# EAGLE design sx3_io_tach (EAGLE 9.5.2)

## Sheet 1 of 2: MAIN
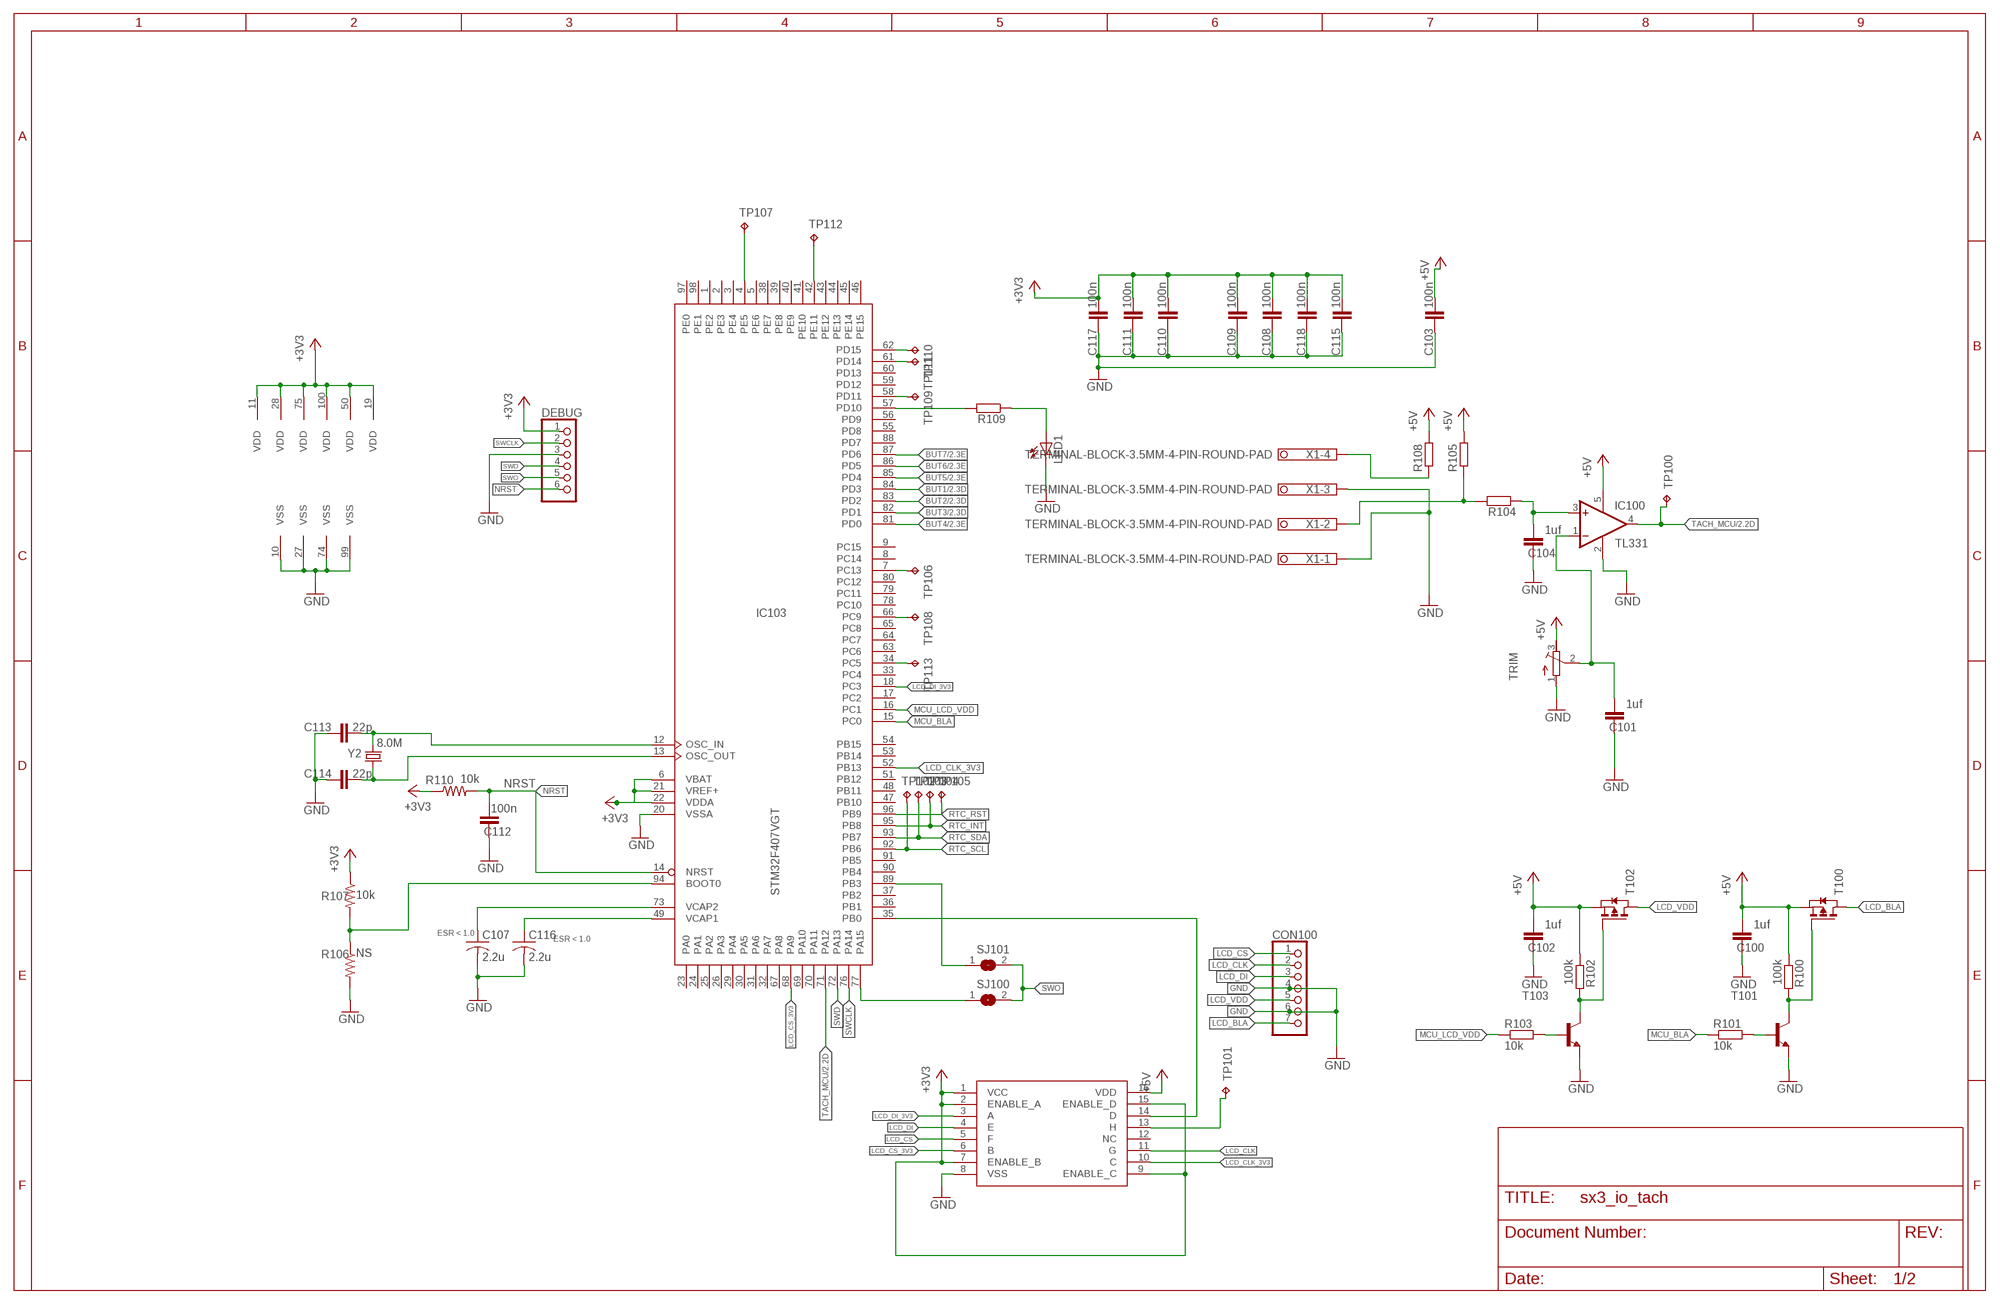
[diagram p0: schematic, sheet 1]

### Parts
C100  1uf  C-EUC0603K  [C0603K]
C101  1uf  C-EUC0603K  [C0603K]
C102  1uf  C-EUC0603K  [C0603K]
C103  100n  C-EUC0603K  [C0603K]
C104  1uf  C-EUC0603K  [C0603K]
C107  2.2u  C-USC1206  [C1206]
C108  100n  C-EUC0603K  [C0603K]
C109  100n  C-EUC0603K  [C0603K]
C110  100n  C-EUC0603K  [C0603K]
C111  100n  C-EUC0603K  [C0603K]
C112  100n  C-EUC0603K  [C0603K]
C113  22p  C-EUC0603K  [C0603K]
C114  22p  C-EUC0603K  [C0603K]
C115  100n  C-EUC0603K  [C0603K]
C116  2.2u  C-USC1206  [C1206]
C117  100n  C-EUC0603K  [C0603K]
C118  100n  C-EUC0603K  [C0603K]
CON100  PINHD-1X7  [1X07]
DEBUG  PINHD-1X6  [1X06]
IC100  TL331  [DBV-R-PDSO-G5]
IC103  STM32F407VGT  [LQFP100]
LED1  LED_ELD260  [LED_LD260]
R100  100k  R-EU_R0603  [R0603]
R101  10k  R-EU_R0603  [R0603]
R102  100k  R-EU_R0603  [R0603]
R103  10k  R-EU_R0603  [R0603]
R104  R-EU_R0603  [R0603]
R105  R-EU_R0603  [R0603]
R106  NS  R-US_R0603  [R0603]
R107  10k  R-US_R0603  [R0603]
R108  R-EU_R0603  [R0603]
R109  R-EU_R0603  [R0603]
R110  10k  R-US_R0603  [R0603]
SJ100  SJ  [SJ]
SJ101  SJ  [SJ]
T100  PMOSSOT23  [SOT-23]
T101  BC817-NPN-SOT23-BEC  [SOT23-BEC]
T102  PMOSSOT23  [SOT-23]
T103  BC817-NPN-SOT23-BEC  [SOT23-BEC]
TP100  TPB1,27  [B1,27]
TP101  TPB1,27  [B1,27]
TP102  TPTP17R  [TP17R]
TP103  TPTP17R  [TP17R]
TP104  TPTP17R  [TP17R]
TP105  TPTP17R  [TP17R]
TP106  TPTP17R  [TP17R]
TP107  TPTP17R  [TP17R]
TP108  TPTP17R  [TP17R]
TP109  TPTP17R  [TP17R]
TP110  TPTP17R  [TP17R]
TP111  TPTP17R  [TP17R]
TP112  TPTP17R  [TP17R]
TP113  TPTP17R  [TP17R]
TRIM  R-TRIMM3296W  [RTRIM3296W]
U$100  CD40109BPWR  [TSSOP16]
X1  TERMINAL-BLOCK-3.5MM-4-PIN-ROUND-PAD  [TERMINAL-BLOCK-4-PIN-3.5MM-ROUND-PAD]
Y2  8.0M  CRYSTALHC49UV  [HC49U-V]

### Nets
+3V3: C108.2 C109.2 C110.2 C111.2 C115.2 C117.2 C118.2 DEBUG.1 IC103.6(VBAT) IC103.11(VDD) IC103.19(VDD) IC103.21(VREF+) IC103.22(VDDA) IC103.28(VDD) IC103.50(VDD) IC103.75(VDD) IC103.100(VDD) R107.1 R110.1 U$100.1(VCC) U$100.2(ENABLE_A) U$100.7(ENABLE_B) U$100.9(ENABLE_C) U$100.15(ENABLE_D) ; also sheet 2
+5V: C100.2 C102.2 C103.2 IC100.5(V+) R100.1 R102.1 R105.2 R108.2 T100.2(S) T102.2(S) TRIM.3(E) U$100.16(VDD) ; also sheet 2
BOOT0: IC103.94(BOOT0) R106.1 R107.2
BUT1: IC103.84(PD3) ; also sheet 2
BUT2: IC103.83(PD2) ; also sheet 2
BUT3: IC103.82(PD1) ; also sheet 2
BUT4: IC103.81(PD0) ; also sheet 2
BUT5: IC103.85(PD4) ; also sheet 2
BUT6: IC103.86(PD5) ; also sheet 2
BUT7: IC103.87(PD6) ; also sheet 2
GND: C100.1 C101.1 C102.1 C103.1 C104.1 C107.2 C108.1 C109.1 C110.1 C111.1 C112.1 C113.1 C114.1 C115.1 C116.2 C117.1 C118.1 CON100.4 CON100.6 DEBUG.3 IC100.2(GND) IC103.10(VSS) IC103.20(VSSA) IC103.27(VSS) IC103.74(VSS) IC103.99(VSS) LED1.K(C) R106.2 T101.E T103.E TRIM.1(A) U$100.8(VSS) X1.1 X1.3 ; also sheet 2
LCD_BLA: CON100.7 T100.1(D)
LCD_CLK: CON100.2 U$100.11(G)
LCD_CLK_3V3: IC103.52(PB13) U$100.10(C)
LCD_CS: CON100.1 U$100.5(F)
LCD_CS_3V3: IC103.68(PA9) U$100.6(B)
LCD_DI: CON100.3 U$100.4(E)
LCD_DI_3V3: IC103.18(PC3) U$100.3(A)
LCD_VDD: CON100.5 T102.1(D)
MCU_BLA: IC103.15(PC0) R101.1
MCU_LCD_VDD: IC103.16(PC1) R103.1
N$1: C101.2 IC100.1(-IN) TRIM.2(S)
N$2: IC103.57(PD10) R109.2
N$3: LED1.A R109.1
N$4: R101.2 T101.B
N$5: R103.2 T103.B
N$6: IC103.35(PB0) U$100.14(D)
N$7: R102.2 T102.3(G) T103.C
N$8: TP101.TP U$100.13(H)
N$9: R100.2 T100.3(G) T101.C
N$10: R108.1 X1.4
N$11: IC103.4(PE5) TP107.TP
N$12: R104.2 R105.1 X1.2
N$13: IC103.42(PE11) TP112.TP
N$14: C104.2 IC100.3(+IN) R104.1
N$15: IC103.66(PC9) TP108.TP
N$16: IC103.7(PC13) TP106.TP
N$17: IC103.34(PC5) TP113.TP
N$18: IC103.61(PD14) TP111.TP
N$19: IC103.62(PD15) TP110.TP
N$20: IC103.58(PD11) TP109.TP
N$21: IC103.89(PB3) SJ101.1
N$22: IC103.77(PA15) SJ100.1
NRST: C112.2 DEBUG.6 IC103.14(NRST) R110.2
OSC_IN: C113.2 IC103.12(OSC_IN) Y2.2
OSC_OUT: C114.2 IC103.13(OSC_OUT) Y2.1
RTC_INT: IC103.95(PB8) TP104.TP
RTC_RST: IC103.96(PB9) TP105.TP
RTC_SCL: IC103.92(PB6) TP102.TP
RTC_SDA: IC103.93(PB7) TP103.TP
SWCLK: DEBUG.2 IC103.76(PA14)
SWD: DEBUG.4 IC103.72(PA13)
SWO: DEBUG.5 SJ100.2 SJ101.2
TACH_MCU: IC100.4(OUT) IC103.71(PA12) TP100.TP ; also sheet 2
VCAP1: C116.1 IC103.49(VCAP1)
VCAP2: C107.1 IC103.73(VCAP2)
Unconnected: IC103.1(PE2) IC103.2(PE3) IC103.3(PE4) IC103.5(PE6) IC103.8(PC14) IC103.9(PC15) IC103.17(PC2) IC103.23(PA0) IC103.24(PA1) IC103.25(PA2) IC103.26(PA3) IC103.29(PA4) IC103.30(PA5) IC103.31(PA6) IC103.32(PA7) IC103.33(PC4) IC103.36(PB1) IC103.37(PB2) IC103.38(PE7) IC103.39(PE8) IC103.40(PE9) IC103.41(PE10) IC103.43(PE12) IC103.44(PE13) IC103.45(PE14) IC103.46(PE15) IC103.47(PB10) IC103.48(PB11) IC103.51(PB12) IC103.53(PB14) IC103.54(PB15) IC103.55(PD8) IC103.56(PD9) IC103.59(PD12) IC103.60(PD13) IC103.63(PC6) IC103.64(PC7) IC103.65(PC8) IC103.67(PA8) IC103.69(PA10) IC103.70(PA11) IC103.78(PC10) IC103.79(PC11) IC103.80(PC12) IC103.88(PD7) IC103.90(PB4) IC103.91(PB5) IC103.97(PE0) IC103.98(PE1) U$100.12(NC)

### Notes on the sheet
- ESR < 1.0
- ESR < 1.0

## Sheet 2 of 2: POWER
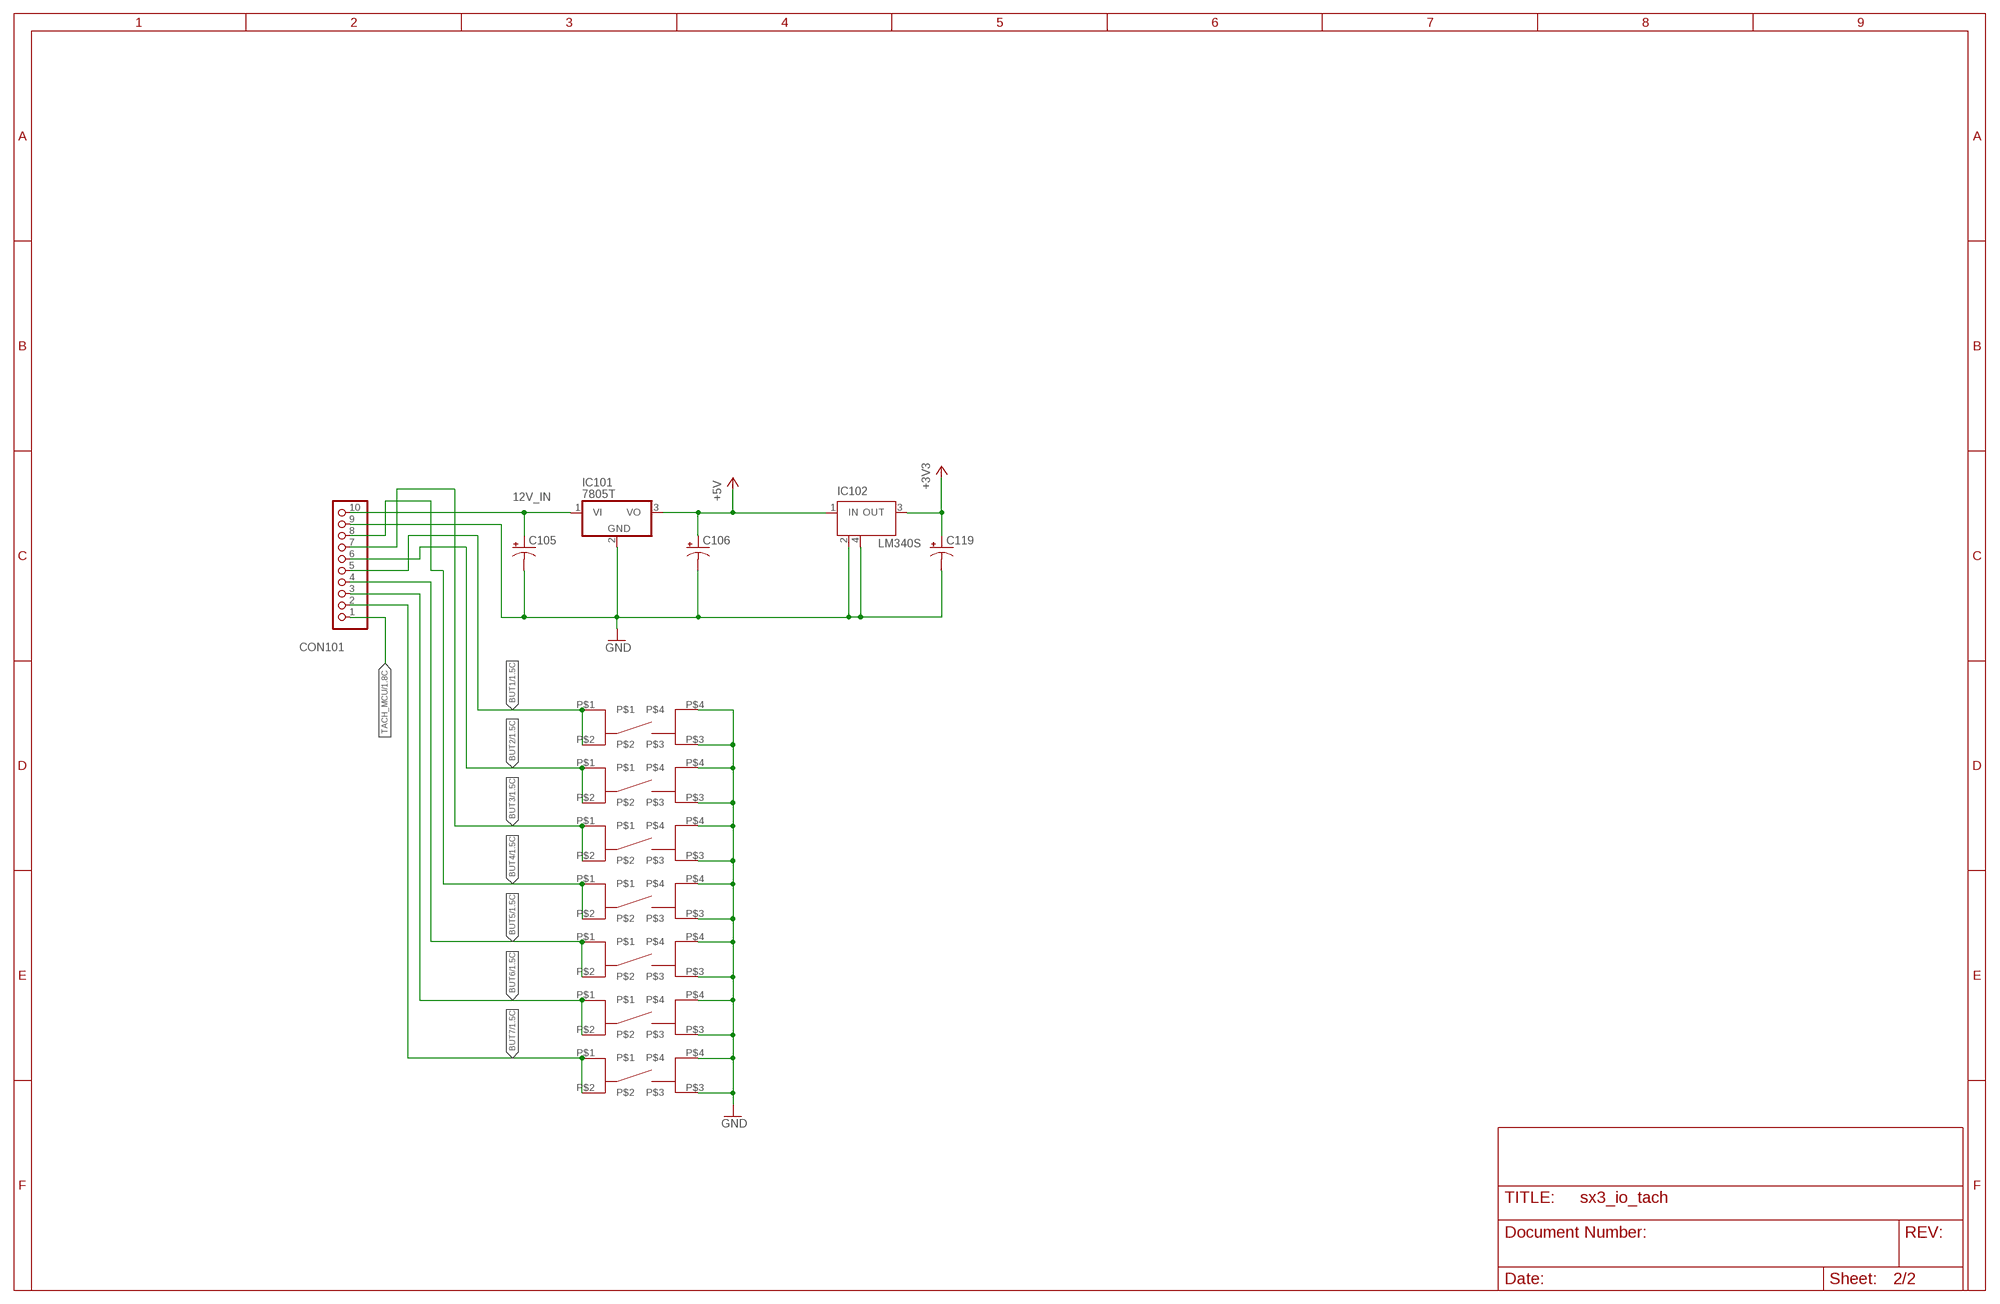
[diagram p1: schematic, sheet 2]

### Parts
C105  CPOL-USE2,5-6E  [E2,5-6E]
C106  CPOL-USE2,5-6E  [E2,5-6E]
C119  CPOL-USE2,5-6E  [E2,5-6E]
CON101  PINHD-1X10  [1X10]
IC101  7805T  [TO220H]
IC102  LM340S  [SOT223]
U$1  TE_2-1825910  [TE_2-1825910-7]
U$2  TE_2-1825910  [TE_2-1825910-7]
U$3  TE_2-1825910  [TE_2-1825910-7]
U$4  TE_2-1825910  [TE_2-1825910-7]
U$5  TE_2-1825910  [TE_2-1825910-7]
U$6  TE_2-1825910  [TE_2-1825910-7]
U$7  TE_2-1825910  [TE_2-1825910-7]

### Nets
12V_IN: C105.+ CON101.10 IC101.1(VI)
+3V3: C119.+ IC102.3(OUT) ; also sheet 1
+5V: C106.+ IC101.3(VO) IC102.1(IN) ; also sheet 1
BUT1: CON101.5 U$7.P$1 U$7.P$2 ; also sheet 1
BUT2: CON101.6 U$5.P$1 U$5.P$2 ; also sheet 1
BUT3: CON101.7 U$3.P$1 U$3.P$2 ; also sheet 1
BUT4: CON101.8 U$1.P$1 U$1.P$2 ; also sheet 1
BUT5: CON101.4 U$2.P$1 U$2.P$2 ; also sheet 1
BUT6: CON101.3 U$4.P$1 U$4.P$2 ; also sheet 1
BUT7: CON101.2 U$6.P$1 U$6.P$2 ; also sheet 1
GND: C105.- C106.- C119.- CON101.9 IC101.2(GND) IC102.2(GND) IC102.4(GND) U$1.P$3 U$1.P$4 U$2.P$3 U$2.P$4 U$3.P$3 U$3.P$4 U$4.P$3 U$4.P$4 U$5.P$3 U$5.P$4 U$6.P$3 U$6.P$4 U$7.P$3 U$7.P$4 ; also sheet 1
TACH_MCU: CON101.1 ; also sheet 1

## Library data of the parts
C100-C104 C108-C115 C117 C118 = rcl:C-EU: CAPACITOR, European symbol
C105 C106 C119 = rcl:CPOL-US: POLARIZED CAPACITOR, American symbol; SPICEPREFIX: C
C107 C116 = rcl:C-US: CAPACITOR, American symbol
CON100 = pinhead:PINHD-1X7: PIN HEADER
CON101 = pinhead:PINHD-1X10: PIN HEADER
DEBUG = pinhead:PINHD-1X6: PIN HEADER
IC100 = linear:TL331: SINGLE DIFFERENTIAL COMPARATOR Source: Data sheet <http://www.ti.com/lit/ds/symlink/tl331-q1.pdf>
IC101 = linear:78*: Positive VOLTAGE REGULATOR Source: http://cache.national.com/ds/LM/LM78L05.pdf http://www.fairchildsemi.com/ds/LM/LM7805.pdf
IC102 = linear:LM340S: 3-Terminal Positive Regulators Source: http://cache.national.com/ds/LM/LM340.pdf
IC103 = micro-stm:STM32F407V*T: ARM 32-bit Cortex™-M3 CPU 168 MHz maximum frequency 512 to 1024 Kbytes of Flash memory 192 kbytes of SRAM 82 GPIOs 1.8 to 3.6 V application supply
LED1 = eagle-ltspice:LED_E: LED Source: http://www.osram.convergy.de Source: www.luxeon.com Source: www.kingbright.com; SPICEMODEL: NONE; SPICEPREFIX: D; SPICETYPE: diode
R100-R105 R108 R109 = resistor:R-EU_: RESISTOR, European symbol
R106 R107 R110 = rcl:R-US_: RESISTOR, American symbol
SJ100 SJ101 = jumper:SJ: SMD solder JUMPER
T100 T102 = zetex:PMOSSOT23: MOS FET; OC_FARNELL: unknown; OC_NEWARK: unknown
T101 T103 = transistor-neu-to92:*-NPN-: NPN Transistror
TP100-TP113 = testpad:TP: Test pad
TRIM = rcl:R-TRIMM: Trimm resistor; SPICEMODEL: X; SPICEPREFIXL: POT
U$1-U$7 = eric_sorensen:TE_2-1825910
U$100 = eric_sorensen:CD40109BPWR
X1 = Rembrandt Electronics - Terminal Block 3-5mm v1-0:TERMINAL-BLOCK-3.5MM-4-PIN: Terminal Block 3.5mm Pitch: 3,5 mm Number of pins: 4 Created by Rembrandt Electronics www.rembrandtelectronics.com
Y2 = SparkFun-FreqCtrl:CRYSTAL: Various standard crystals. Proven footprints.

## Board
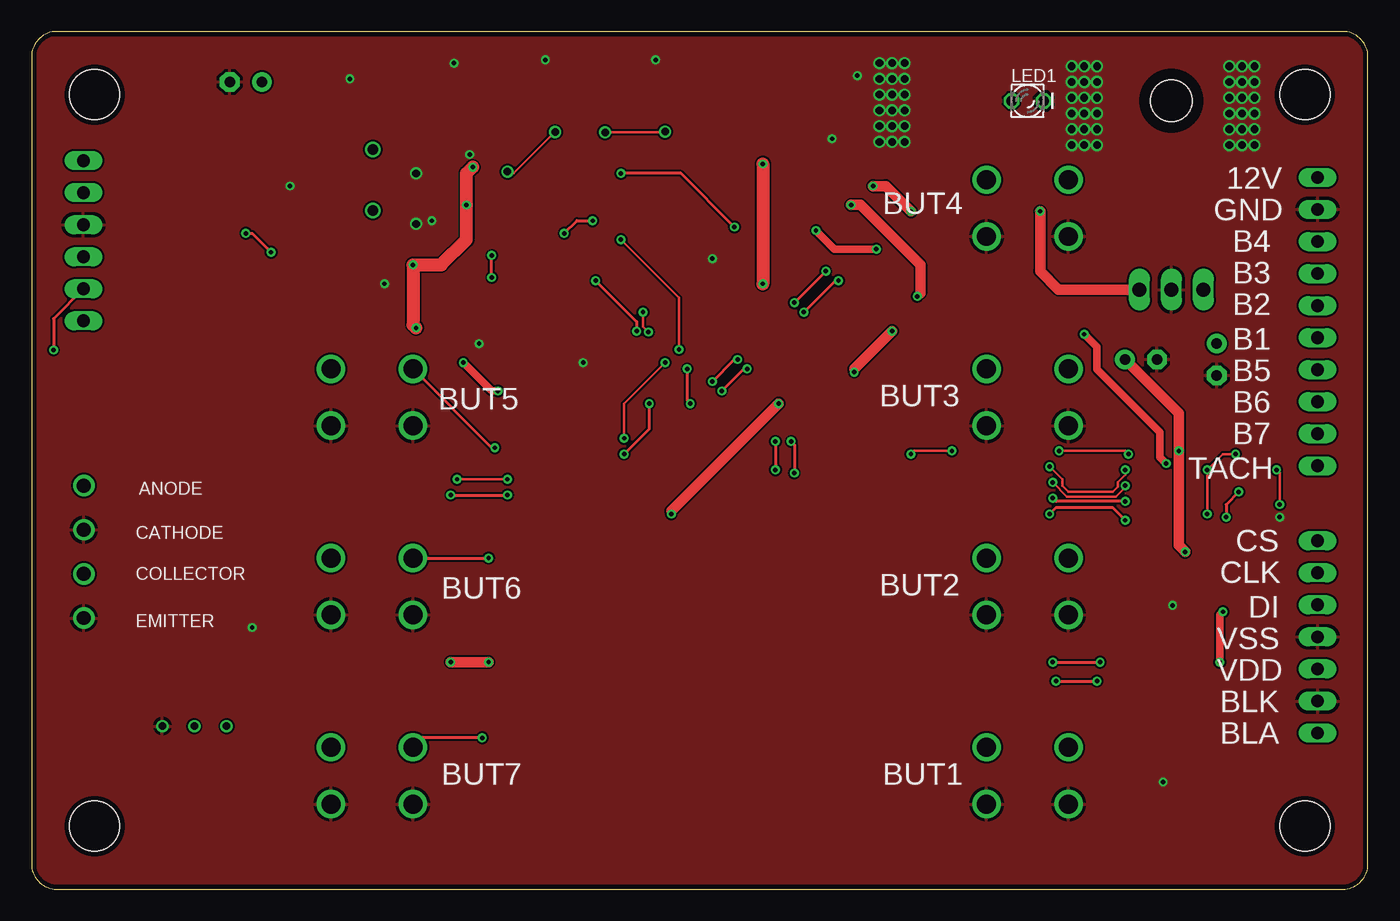
[diagram p2: board, top side]
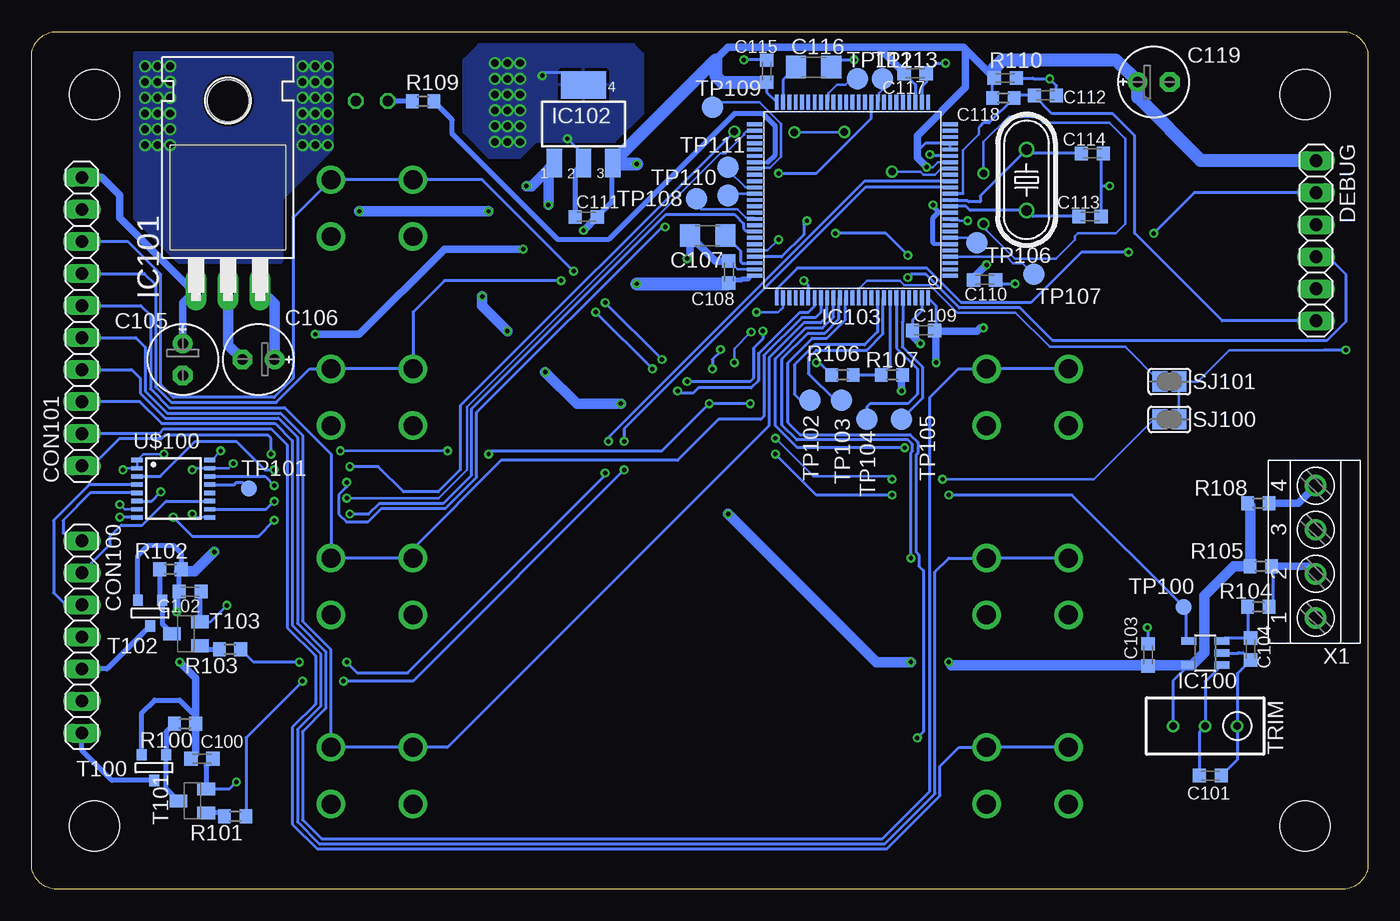
[diagram p3: board, bottom side, seen from below]

Size 106 x 68 mm. Coordinates in mm from the lower left corner, seen from the top.
Outline: 0,66 0,2 arc90 2,0 104,0 arc90 106,2 106,66 arc90 104,68 2,68 arc90 0,66
Copper layers (1*16): Top 0.0356mm / dielectric 1.5011mm / Bottom 0.0356mm
Design rules "LaenPCBOrder": minimum track width 6mil, minimum drill 13mil, track to track 6mil, track to pad 6mil, pad to pad 6mil, via to via 6mil, smd to smd 6mil, copper to edge 15mil, drill to drill 6mil, minimum pad ring 7mil, minimum via ring 7mil, stop-mask expansion 3mil, vias tented up to drill 0mil, thermal gap 10mil
Holes 4 mm at 101,63 101,5 5,5 5,63

### Footprints (pad centres in the part's own frame; a part is rotated, then mirrored left to right if it is on the bottom)
C0603K = smd 1.05 x 1.08: 1 -0.875,0; 2 0.875,0
E2,5-6E = drill 0.813 pad 1.575: + -1.27,0 | drill 0.813 pad 1.575 octagon: - 1.27,0
C1206 = smd 1.6 x 1.8: 1 -1.4,0; 2 1.4,0
1X07 = drill 1.016 long: 1 -7.62,0; 2 -5.08,0; 3 -2.54,0; 4 0,0; 5 2.54,0; 6 5.08,0; 7 7.62,0
1X10 = drill 1.016 long: 1 -11.43,0; 2 -8.89,0; 3 -6.35,0; 4 -3.81,0; 5 -1.27,0; 6 1.27,0; 7 3.81,0; 8 6.35,0; 9 8.89,0; 10 11.43,0
1X06 = drill 1.016 long: 1 -6.35,0; 2 -3.81,0; 3 -1.27,0; 4 1.27,0; 5 3.81,0; 6 6.35,0
DBV-R-PDSO-G5 = smd 0.6 x 1.2: 1 -0.95,-1.306; 2 0,-1.306; 3 0.95,-1.306; 4 0.95,1.306; 5 -0.95,1.306
TO220H = drill 1.118 long: 1 -2.54,-10.16; 2 0,-10.16; 3 2.54,-10.16 | hole 3.302: 0,4.826
SOT223 = smd 1.219 x 2.235: 1 -2.311,-3.099; 2 0,-3.099; 3 2.311,-3.099 | smd 3.6 x 2.2: 4 0,3.099
LQFP100 = smd 0.3 x 1.2: 1 -6,-7.75; 2 -5.5,-7.75; 3 -5,-7.75; 4 -4.5,-7.75; 5 -4,-7.75; 6 -3.5,-7.75; 7 -3,-7.75; 8 -2.5,-7.75; 9 -2,-7.75; 10 -1.5,-7.75; 11 -1,-7.75; 12 -0.5,-7.75; 13 0,-7.75; 14 0.5,-7.75; 15 1,-7.75; 16 1.5,-7.75; 17 2,-7.75; 18 2.5,-7.75; 19 3,-7.75; 20 3.5,-7.75; 21 4,-7.75; 22 4.5,-7.75; 23 5,-7.75; 24 5.5,-7.75; 25 6,-7.75; 51 6,7.75; 52 5.5,7.75; 53 5,7.75; 54 4.5,7.75; 55 4,7.75; 56 3.5,7.75; 57 3,7.75; 58 2.5,7.75; 59 2,7.75; 60 1.5,7.75; 61 1,7.75; 62 0.5,7.75; 63 0,7.75; 64 -0.5,7.75; 65 -1,7.75; 66 -1.5,7.75; 67 -2,7.75; 68 -2.5,7.75; 69 -3,7.75; 70 -3.5,7.75; 71 -4,7.75; 72 -4.5,7.75; 73 -5,7.75; 74 -5.5,7.75; 75 -6,7.75 | smd 1.2 x 0.3: 26 7.75,-6; 27 7.75,-5.5; 28 7.75,-5; 29 7.75,-4.5; 30 7.75,-4; 31 7.75,-3.5; 32 7.75,-3; 33 7.75,-2.5; 34 7.75,-2; 35 7.75,-1.5; 36 7.75,-1; 37 7.75,-0.5; 38 7.75,0; 39 7.75,0.5; 40 7.75,1; 41 7.75,1.5; 42 7.75,2; 43 7.75,2.5; 44 7.75,3; 45 7.75,3.5; 46 7.75,4; 47 7.75,4.5; 48 7.75,5; 49 7.75,5.5; 50 7.75,6; 76 -7.75,6; 77 -7.75,5.5; 78 -7.75,5; 79 -7.75,4.5; 80 -7.75,4; 81 -7.75,3.5; 82 -7.75,3; 83 -7.75,2.5; 84 -7.75,2; 85 -7.75,1.5; 86 -7.75,1; 87 -7.75,0.5; 88 -7.75,0; 89 -7.75,-0.5; 90 -7.75,-1; 91 -7.75,-1.5; 92 -7.75,-2; 93 -7.75,-2.5; 94 -7.75,-3; 95 -7.75,-3.5; 96 -7.75,-4; 97 -7.75,-4.5; 98 -7.75,-5; 99 -7.75,-5.5; 100 -7.75,-6
LED_LD260 = drill 0.813 octagon: A -1.27,0; K 1.27,0
R0603 = smd 1 x 1.1: 1 -0.85,0; 2 0.85,0
SJ = smd 1.168 x 1.6: 1 -0.762,0; 2 0.762,0
SOT-23 = smd 0.787 x 0.889: 1 0.025,-1.016; 2 -0.94,1.016; 3 0.991,1.016
SOT23-BEC = smd 1 x 1.4: B -0.95,-1.1; C 0,1.1; E 0.95,-1.1
B1,27 = smd 1.27 x 1.27: TP 0,0
TP17R = smd 1.7 x 1.7: TP 0,0
RTRIM3296W = drill 0.61: 1 0,-2.54; 2 0,0; 3 0,2.54
TE_2-1825910-7 = drill 1.5: P$1 -3.25,2.25; P$2 3.25,2.25; P$3 3.25,-2.25; P$4 -3.25,-2.25
TSSOP16 = smd 0.9 x 0.35: 1 -2.875,2.275; 2 -2.875,1.625; 3 -2.875,0.975; 4 -2.875,0.325; 5 -2.875,-0.325; 6 -2.875,-0.975; 7 -2.875,-1.625; 8 -2.875,-2.275; 9 2.875,-2.275; 10 2.875,-1.625; 11 2.875,-0.975; 12 2.875,-0.325; 13 2.875,0.325; 14 2.875,0.975; 15 2.875,1.625; 16 2.875,2.275
TERMINAL-BLOCK-4-PIN-3.5MM-ROUND-PAD = drill 1.1 pad 1.7: 1 -5.25,-0.1; 2 -1.75,-0.1; 3 1.75,-0.1; 4 5.25,-0.1
HC49U-V = drill 0.813: 1 -2.413,0; 2 2.413,0

### Placement (x,y rotation side)
C100  92.49,10.34 180 bottom
C101  12.5,9 180 bottom
C102  93.42,23.59 180 bottom
C103  17.44,18.58 270 bottom
C104  9.31,19.04 90 bottom
C105  94,42 270 bottom
C106  88,42 180 bottom
C107  52.37,51.82 180 bottom
C108  50.69,48.93 270 bottom
C109  35.25,44.31 0 bottom
C110  30.41,48.31 180 bottom
C111  62.01,53.31 0 bottom
C112  25.58,62.94 180 bottom
C113  22.05,53.34 180 bottom
C114  21.86,58.34 180 bottom
C115  47.69,64.85 270 bottom
C116  43.98,65.18 0 bottom
C117  35.91,64.69 180 bottom
C118  28.77,64.31 180 bottom
C119  17,64 0 bottom
CON100  102,20 270 bottom
CON101  102,45 90 bottom
DEBUG  4.12,51.41 270 bottom
IC100  12.91,18.72 90 bottom
IC101  90.41,57.7 0 bottom
IC102  62.22,60.67 0 bottom
IC103  40.89,54.64 90 bottom
LED1  79,62.5 0 top
R100  93.83,13.12 180 bottom
R101  89.84,5.77 180 bottom
R102  94.98,25.37 180 bottom
R103  90.26,19.02 180 bottom
R104  8.69,22.39 0 bottom
R105  8.5,25.61 180 bottom
R106  41.67,40.77 180 bottom
R107  37.75,40.77 180 bottom
R108  8.69,30.61 180 bottom
R109  74.95,62.47 0 bottom
R110  28.92,62.73 0 bottom
SJ100  15.75,37.25 0 bottom
SJ101  15.75,40.25 0 bottom
T100  96.31,9.64 0 bottom
T101  93.25,7 90 bottom
T102  96.62,21.89 0 bottom
T103  93.75,20.25 90 bottom
TP100  14.62,22.39 0 bottom
TP101  88.75,31.75 0 bottom
TP102  44.25,38.75 0 bottom
TP103  41.75,38.75 0 bottom
TP104  39.75,37.25 0 bottom
TP105  37,37.25 0 bottom
TP106  31,51.25 0 bottom
TP107  26.5,48.75 0 bottom
TP108  53.25,54.75 0 bottom
TP109  52,62 0 bottom
TP110  50.75,55 0 bottom
TP111  50.75,57.25 0 bottom
TP112  40.5,64.25 0 bottom
TP113  38.5,64.25 0 bottom
TRIM  12.92,12.93 90 bottom
U$1  79,54 0 top
U$2  27,39 0 top
U$3  79,39 0 top
U$4  27,24 0 top
U$5  79,24 0 top
U$6  27,9 0 top
U$7  79,9 0 top
U$100  94.75,31.75 0 bottom
X1  4.25,26.75 90 bottom
Y2  27.08,56.23 270 bottom

### Tracks (layer width: path | path; a pad name or v marks a point on that pad's centre or on a via)
12V_IN
  Bottom 0.4: IC101.1 93.29,47.54
  Bottom 0.61: IC101.1 94,46.49 C105.+ | 93.29,47.54 99,53.25 99,55 100.43,56.43 CON101.10
+3V3  (via drill 0.33, 0.35)
  Top 0.2: v93.25,29.75 v93.25,33.25 94.5,34.5 v95.5,34.5 | v98.75,33.25 99,33 v99,30.5
  Top 0.61: v37,39.5 36.5,39.5 v34.25,41.75 | v62.22,52.22 63.7,50.75 v67,50.75 | v83.5,44 84.48,43.02 84.48,41.23 89.5,36.22 89.5,34.25 v90,33.75
  Top 1.016: v30.5,44.5 30.25,44.75 v30.25,49.5 32.5,49.5 34.5,51.5 v34.5,54.25 34.5,56.75 v35,57.25 | v58,57.5 v58,48
  Bottom 0.2: v90,33.75 90.38,33.38 U$100.15 93.12,33.38 v93.25,33.25 | v93.25,29.75 92.97,29.48 U$100.9 | v95.5,34.5 97.15,34.5 U$100.1 U$100.2 98.62,33.38 v98.75,33.25 | v99,30.5 98.62,30.12 U$100.7 | v35,57.25 34.5,57.25 34.11,57.64 IC103.19 | 35.75,58.5 35.75,58
  Bottom 0.254: IC103.100 34.25,46.25 34.25,44.44 C109.2 | IC103.21 IC103.22 35.11,59.14 35.75,58.5 | R110.1 29.77,64.19 C118.2 | C115.2 47.69,63.19 IC103.50 | C117.2 35.89,63.8 IC103.28 | 34.11,53.64 34.5,54.03 v34.5,54.25 33.89,53.64
  Bottom 0.305: IC103.75 48.89,48.64 49.14,48.39 | IC103.6 34.39,51.14 34.5,51.25 | 33.89,53.64 IC103.11
  Bottom 0.4: 34.5,51.25 34.5,53.25 34.11,53.64
  Bottom 0.406: IC102.3 60,57.48 60,54.45 C111.2 | 49.14,48.39 49.64,48.39 49.73,48.3 50.44,48.3 C108.2
  Bottom 0.61: 29.64,65.11 C118.2 31.92,66.58 | R107.1 37,40.67 v37,39.5 | v34.25,41.75 34.25,44.44 | C110.2 31.29,48.47 v30.25,49.5 | v30.5,44.5 30.75,44.5 31,44.25 34.31,44.25 C109.2 | C117.2 38.84,66.75 | 38.84,66.75 50.75,66.75 51.75,65.75 | 31.92,66.58 32.09,66.75 38.84,66.75 | 60,57.5 60,57.48 | IC102.3 59.84,57.5 | 50.74,48 C108.2 | v67,50.75 73.25,50.75 80,44 v83.5,44 | 31.92,66.58 31.92,63.58 35.75,59.75 35.75,58 v35,57.25 | v62.22,52.22 C111.2
  Bottom 1.016: 29.64,65.11 29,65.75 20.02,65.75 C119.+ 18.27,62.77 13.26,57.76 DEBUG.1 | C115.2 51.23,63.98 51.75,64.5 51.75,65.75 60,57.5 | 59.84,57.5 v58,57.5 | v58,48 50.74,48
+5V  (via drill 0.35)
  Top 0.61: v94.25,18 94.25,21.75 v94.5,22 | 70.5,47.25 v70.25,47 | 65.25,41.25 v65.25,41 | 50.75,30 v50.75,29.75
  Top 0.813: C106.+ 91,37.73 v91,34.75 91,27.25 v91.5,26.75 | v66.75,55.75 67.75,55.75 v69.75,53.75 | IC101.3 81.46,47.54 80,49 v80,53.75 | v65,54.25 65.75,54.25 70.5,49.5 70.5,47.25 | v68.25,44.25 65.25,41.25 | v59.25,38.5 50.75,30 | v36.25,18 v33.25,18
  Bottom 0.203: v91,34.75 91.72,34.02 U$100.16
  Bottom 0.254: 9.35,30.42 R108.2 | 17.25,17.77 17.38,17.77 C103.2 | TRIM.3 15.46,16.53 IC100.5 13.98,17.77
  Bottom 0.406: C102.2 94.3,25.2 R102.1 94.13,26.63 94.75,27.25 96.75,27.25 97.56,26.44 T102.2 | T100.2 97.25,14 96.25,15 94.25,15 92.98,13.73 R100.1
  Bottom 0.61: C100.2 92.98,10.72 R100.1 92.98,16.73 v94.25,18 | v94.5,22 94.5,23.39 C102.2 | IC102.1 65,57.1 | v33.25,18 33.02,17.77
  Bottom 0.813: IC101.3 86.73,46.4 C106.+ | 9.35,30.42 R105.2 10.64,25.61 13,23.25 13,18.75 13.98,17.77 | IC100.5 17.25,17.77 33.02,17.77 | v91.5,26.75 93.05,25.2 94.3,25.2 | IC102.1 66.35,55.75 v66.75,55.75 | v69.75,53.75 v80,53.75 | 65,57.1 v65,54.25 | v70.25,47 70.25,46.25 v68.25,44.25 | v65.25,41 62.75,38.5 v59.25,38.5 | v50.75,29.75 39,18 v36.25,18
BOOT0
  Bottom 0.254: R106.1 R107.2 37.89,41.48 IC103.94
BUT1
  Bottom 0.254: CON101.5 97.73,43.73 96.97,42.97 96.97,39.49 95.22,37.75 86.25,37.75 84.5,36 84.5,21.25 82.25,19 U$7.P$2 U$7.P$1 73,11.25 47.5,36.75 47.5,42.15 44.74,44.91 43.42,44.91 42.96,45.36 42.96,46.82 IC103.84
BUT2
  Bottom 0.254: CON101.6 97.33,46.27 96.56,45.5 96.56,39.66 95.09,38.19 85.94,38.19 82.25,34.5 U$5.P$2 U$5.P$1 75.75,27 68.75,34 54.75,34 51.5,37.25 48.16,37.25 47.91,37.5 47.91,42.32 44.91,45.31 43.8,45.31 43.37,45.75 43.37,45.87 43.39,45.89 IC103.83
BUT3  (via drill 0.35)
  Top 0.254: v54.75,39.5 56.5,41.25 v56.75,41.25 | v61.25,45.75 63.75,48.25 v64,48.25
  Bottom 0.254: CON101.7 97.06,48.81 96.16,47.91 96.16,39.83 94.92,38.59 86.58,38.59 83.92,41.25 U$3.P$2 U$3.P$1 75.75,45.75 73.25,48.25 v64,48.25 | IC103.82 43.96,46.82 43.96,46.17 44.42,45.72 45.08,45.72 48.34,42.45 48.34,40.33 48.92,39.75 53.11,39.75 53.49,39.37 54.62,39.37 v54.75,39.5 | v56.75,41.25 v61.25,45.75
BUT4  (via drill 0.35)
  Top 0.254: v44.75,48.25 48,45 v48,44.25 | v54,40.25 55.75,42 v56,42 | v60.5,46.5 v63,49
  Bottom 0.254: CON101.8 98.35,51.35 95.75,48.75 95.75,40 94.75,39 86.75,39 85.25,40.5 85.25,53.25 U$1.P$2 U$1.P$1 70.25,56.25 v63,49 | IC103.81 44.39,47.89 v44.75,48.25 | v48,44.25 48,43.62 48.75,42.87 48.75,40.5 49,40.25 v54,40.25 | v56,42 v60.5,46.5
BUT5  (via drill 0.35)
  Top 0.254: U$2.P$2 36.5,35 v36.75,35
  Bottom 0.254: U$2.P$1 U$2.P$2 32.5,41.25 34.75,39 34.75,7.75 38.5,4 83,4 84.5,5.5 84.5,12.5 82.66,14.34 82.66,18.83 84.91,21.08 84.91,35.83 86.42,37.34 95.39,37.34 97.38,39.33 97.38,40.5 98.07,41.19 CON101.4 | v36.75,35 45.25,35 47,36.75 47,42.08 44.58,44.5 43.25,44.5 42.39,45.36 42.39,46.36 42.39,46.5 IC103.85
BUT6  (via drill 0.35)
  Top 0.254: U$4.P$2 v36.25,26.25
  Bottom 0.254: U$4.P$1 U$4.P$2 33.25,26.25 34.34,25.16 34.34,7.58 38.33,3.59 83.17,3.59 84.91,5.33 84.91,12.67 83.06,14.51 83.06,18.66 85.31,20.91 85.31,35.56 86.69,36.94 95.69,36.94 97.4,38.65 CON101.3 | v36.25,26.25 36.25,34.61 36.12,34.74 36.12,35.26 36.49,35.63 45.31,35.63 46.46,36.79 46.46,42.04 44.41,44.09 43.08,44.09 41.96,45.22 41.96,46.82 IC103.86
BUT7  (via drill 0.35)
  Top 0.254: v35.75,12 31,12 U$6.P$2
  Bottom 0.254: U$6.P$1 U$6.P$2 32.44,11.25 33.94,9.75 33.94,7.41 38.16,3.19 83.34,3.19 85.31,5.16 85.31,12.84 83.47,14.68 83.47,18.5 85.72,20.75 85.72,35.22 87,36.5 95.5,36.5 95.89,36.11 CON101.2 | IC103.87 41.46,46.82 41.46,45.14 42.91,43.69 44.06,43.69 46,41.75 46,37 45.04,36.04 36.32,36.04 35.71,35.43 35.71,34.57 35.84,34.44 35.84,26.74 35.62,26.51 35.62,25.62 35.25,25.25 35.25,12.5 v35.75,12
GND  (via drill 0.35, 0.6)
  Bottom 0.2: IC103.74 50.02,49.14 C108.1 | IC103.10 33.04,53.04 32.44,53.04 32.39,53 v31.75,53 | v30.5,52.75 30.25,52.5 30.25,52.25 28,50 24.75,50 23.25,51.5 23.25,51.75 23,52 20,52 19.25,52.75 19.25,59.5 20.5,60.75 25.75,60.75 26.25,61.25 28.5,61.25 30.5,59.25 v30.5,56.75
  Bottom 0.254: IC103.99 35.39,45.86 36.12,45.12 C109.1 | C118.1 26.56,64.31 26.5,64.25 v25.25,64.25 24.7,63.7 C112.1 | C114.1 21.18,58.15 21.18,55.75 | 21.18,55.75 C113.1 | v20.5,55.75 21.18,55.75 | v33.5,65.5 34.23,65.5 C117.1 35.03,63.97 35.39,63.61 IC103.27 | C116.2 42.01,65.75 v40.75,65.75 | C115.1 47.72,65.75 v49.5,65.75 | IC102.4 63.2,64.75 65.5,64.75 v65.5,64.5 | IC102.2 62.22,58.22 v63.5,59.5 | R106.2 43.5,41.75 v43.75,41.75 | IC100.2 10.28,18.72 10.25,18.75 9.89,18.75 C104.1 10.38,17.09 TRIM.1 10.38,10.24 C101.1 | C103.1 17.44,20.69 v17.5,20.75 | T103.E 91.8,21.2 v90.5,22.5 | T101.E 90.3,7.95 v89.75,8.5 | U$100.8 98.97,29.48 v99,29.5 | C110.1 29.23,48 v28,48 | IC103.20 34.64,58.14 v34.75,58.25
  Bottom 0.406: C100.1 92.15,9.8 T101.E | C102.1 92.65,23.48 T103.E | IC102.2 62.88,56.91 C111.1
  Bottom 0.61: C109.1 36.12,43.88 v35.5,43.25 | C108.1 51.76,49.8 C107.2 53.77,50.23 v54,50
  Bottom 0.813: IC101.2 90.41,43.14 C106.-
  other vias: 84.5,65.25 83.5,65.25 82.5,65.25 84.5,64 83.5,64 82.5,64 84.5,62.75 83.5,62.75 82.5,62.75 84.5,61.5 83.5,61.5 82.5,61.5 84.5,60.25 83.5,60.25 82.5,60.25 84.5,59 83.5,59 82.5,59 97,65.25 96,65.25 95,65.25 97,64 96,64 95,64 97,62.75 96,62.75 95,62.75 97,61.5 96,61.5 95,61.5 97,60.25 96,60.25 95,60.25 97,59 96,59 95,59 69.25,65.5 68.25,65.5 67.25,65.5 69.25,64.25 68.25,64.25 67.25,64.25 69.25,63 68.25,63 67.25,63 69.25,61.75 68.25,61.75 67.25,61.75 69.25,60.5 68.25,60.5 67.25,60.5 69.25,59.25 68.25,59.25 67.25,59.25
  pour Top: 0.5,67.75 105.75,67.75 105.75,0.25 0.25,0.25 0.25,67.75
  pour Bottom: 82.25,66.25 82.25,58.75 86.25,54.75 86.25,49.75 94.25,49.75 97.75,53.25 97.75,66.25
  pour Bottom: 57.5,66.25 57.5,61.5 59.75,59.25 66,59.25 67.25,58 69.75,58 71.75,60 71.75,63.25 71.75,65.75 70.5,67 58.25,67
LCD_BLA
  Bottom 0.406: T100.1 99.62,8.62 102,11 CON100.7
LCD_CLK
  Bottom 0.254: CON100.2 99.75,27.33 99.75,28 98.88,28.87 97.21,28.87 95.31,30.77 U$100.11
LCD_CLK_3V3  (via drill 0.35)
  Top 0.254: v86.75,30.75 81.25,30.75 v81,31
  Bottom 0.2: IC103.52 48.74,60.04 49.34,60.04 49.49,59.9 49.49,59.8 50.94,58.35 51.36,58.35 71.47,38.24 71.47,33.24 73.71,31 v81,31
  Bottom 0.254: U$100.10 87.38,30.12 v86.75,30.75
LCD_CS
  Bottom 0.254: U$100.5 101.33,31.43 103.5,29.25 103.5,28.25 102.87,27.62 CON100.1
LCD_CS_3V3  (via drill 0.35)
  Top 0.254: v95.75,31.5 94.75,30.5 v94.75,29.5 | v86.75,29.25 85.75,30.25 81.25,30.25 v80.75,29.75
  Bottom 0.254: U$100.6 96.47,30.77 v95.75,31.5 | v94.75,29.5 93.25,28 88,28 v86.75,29.25 | v80.75,29.75 79.25,29.75 78.41,30.59 73.33,30.59 71.09,32.83 71.09,38.08 55.67,53.5 50.25,53.5 49.52,52.77 49.52,52.37 49.36,52.21 48.71,52.21 IC103.68
LCD_DI
  Bottom 0.254: U$100.4 101.42,32.08 104.25,29.25 104.25,23.5 103.25,22.5 102.04,22.5 CON100.3
LCD_DI_3V3  (via drill 0.35, 0.6)
  Top 0.2: v80.75,33.5 81.75,32.5 81.75,32 82.25,31.5 85.75,31.5 86.14,31.89 86.14,32.25 86.75,32.86 v86.75,33.25 | v50.26,60.07 50.19,60 v45.5,60 | v41.53,60.03 38.25,56.75 37.75,56.75 v37.75,56.9
  Bottom 0.2: v45.5,60 41.5,60 v41.53,60.03 | v37.75,56.9 35.5,56.9 35.25,56.65 34.35,56.65 33.86,57.14 IC103.18
  Bottom 0.254: U$100.3 95.78,32.73 93,35.5 89.75,35.5 87.5,33.25 v86.75,33.25 | v50.26,60.07 72,38.33 72,33.25 73.75,31.5 76.5,31.5 78.5,33.5 v80.75,33.5
LCD_VDD
  Bottom 0.406: T102.1 100.01,17.46 CON100.5
MCU_BLA  (via drill 0.35)
  Top 0.254: v59,35.5 v59,33.25 | v81.25,16.5 v84.5,16.5
  Bottom 0.254: IC103.15 39.86,55.64 59,36.5 v59,35.5 | v81.25,16.5 76,16.5 75.75,16.5 v59,33.25 | v84.5,16.5 88.99,12.01 R101.1
MCU_LCD_VDD  (via drill 0.35)
  Top 0.254: v60.25,35.5 60.5,35.25 v60.5,33 | v81,18 v84.75,18
  Bottom 0.254: IC103.16 39.94,56.14 60.25,35.83 v60.25,35.5 | v60.5,33 60.5,32.83 76.17,17.16 80.16,17.16 v81,18 | v84.75,18 88.39,18 R103.1
N$1
  Bottom 0.254: IC100.1 12.92,16.45 TRIM.2 13.38,12.47 C101.2
N$2
  Bottom 0.254: IC103.57 47.61,57.64
  Bottom 0.4: R109.2 72.63,61 72.63,59.88 64.25,51.5 60.25,51.5 50.25,61.5 48,61.5 47,60.5 47,58.25 47.61,57.64
N$3
  Bottom 0.254: 77.7,62.47 LED1.A
  Bottom 0.4: R109.1 77.7,62.47
N$4
  Bottom 0.152: R101.2 90.97,6.05
  Bottom 0.406: 90.97,6.05 T101.B
N$5
  Bottom 0.406: T103.B 92.37,19.02 R103.2
N$6  (via drill 0.35)
  Top 0.2: v81,32.25 82.12,31.13 86,31.13 86.75,31.88 v86.75,32
  Top 0.254: v55.75,52.5 51.5,56.75 v46.75,56.75
  Bottom 0.254: U$100.14 87.47,32.73 v86.75,32 | v81,32.25 81,31.89 81.63,31.26 81.63,29.74 81.01,29.12 79.31,29.12 78.24,30.19 73.16,30.19 70.69,32.66 70.69,37.81 56,52.5 v55.75,52.5 | v46.75,56.75 43.75,56.75 39.39,61.11 IC103.35
N$7
  Bottom 0.406: T103.C 95.63,21.03 T102.3 95.83,23.11 R102.2
N$8
  Bottom 0.254: U$100.13 89.92,32.08 89.75,32.25 89.25,32.25 TP101.TP
N$9
  Bottom 0.406: T101.C 95.32,7.97 T100.3 95.32,12.48 R100.2
N$10
  Bottom 0.61: R108.1 5.54,30.61 X1.4
N$11
  Bottom 0.2: TP107.TP 27.4,49.65 28.15,49.65 28.64,50.14 IC103.4
N$12
  Bottom 0.254: R105.1 7.5,25.61 7.5,22.73 R104.2
  Bottom 0.61: X1.2 4.76,25.61 7.5,25.61
N$13
  Bottom 0.2: IC103.42 42.79,62.49 42.79,63.09 42.11,63.78 41.42,63.78 40.95,64.25 TP112.TP
N$14
  Bottom 0.254: R104.1 9.54,20.14 C104.2 11.36,19.91 IC100.3
N$15
  Bottom 0.2: IC103.66 48.74,53.24 49.34,53.24 50.01,53.9 52.9,53.9 53.25,54.25 TP108.TP
N$16
  Bottom 0.2: TP106.TP 31.39,51.64 IC103.7
N$17
  Bottom 0.2: IC103.34 38.79,62.49 38.79,63.09 38.5,63.39 TP113.TP
N$18
  Bottom 0.2: IC103.61 49.39,55.64 50.75,57 TP111.TP
N$19
  Bottom 0.2: IC103.62 50.61,55.14 TP110.TP
N$20
  Bottom 0.2: IC103.58 48.59,57.19 47.42,57.19 46.55,58.06 46.55,60.69 48.25,62.39 51.61,62.39 TP109.TP
N$21
  Bottom 0.2: SJ101.1 19.26,43 25.25,43 27.96,45.71 32.58,45.71 34.76,47.9 36.75,47.9 37.11,48.25 39.75,48.25 40.39,47.61 IC103.89
N$22  (via drill 0.35)
  Top 0.2: v33.75,32.5 v37.75,32.5 | v47,35.75 47,38.5 v50.25,41.75 | v48.93,44.18 48.5,44.61 v48.5,45.75
  Bottom 0.2: SJ100.1 17,37.25 21.75,32.5 v33.75,32.5 | v37.75,32.5 38,32.75 44,32.75 v47,35.75 | v50.25,41.75 50.25,42.86 v48.93,44.18 | v48.5,45.75 46.79,45.75 46.55,45.99 46.51,45.99 46.39,46.11 IC103.77
NRST
  Bottom 0.2: 30.75,60.5 30.87,60.38 30.87,59.84 32.11,58.6 32.11,55.14
  Bottom 0.254: C112.2 26.5,62.94 | 26.5,62.94 27.86,62.94 R110.2 30.05,60.75 30.5,60.75 30.75,60.5 | 32.11,55.14 IC103.14 | DEBUG.6 11.56,45.06 18.5,52 18.5,59.75 20.25,61.5 25.06,61.5 26.5,62.94
OSC_IN
  Bottom 0.254: C113.2 26.6,53.34 Y2.2 31.57,53.82 31.89,54.14 IC103.12
OSC_OUT
  Bottom 0.254: C114.2 26.78,58.34 Y2.1 30.75,54.97 30.75,54.5 31.68,54.5 31.75,54.57 33.07,54.57 IC103.13
RTC_INT
  Bottom 0.254: IC103.95 37.39,42.89 35.75,41.25 35.75,39.25 36.5,38.5 39.5,38.5 39.75,38.25 TP104.TP
RTC_RST
  Bottom 0.254: IC103.96 36.89,45.01 36.93,44.97 36.93,43 35.34,41.42 35.34,38.91 TP105.TP
RTC_SCL
  Bottom 0.254: IC103.92 38.89,44.19 39.92,43.16 43.75,43.16 43.92,43.16 45.5,41.58 45.5,39.25 45,38.75 TP102.TP
RTC_SDA
  Bottom 0.254: IC103.93 38.46,46.82 38.46,44.04 39.75,42.75 43.75,42.75 44.38,42.12 44.38,40.88 42.25,38.75 TP103.TP
SWCLK  (via drill 0.35)
  Top 0.254: v17,52 17.5,52 v19,50.5
  Bottom 0.254: DEBUG.2 13.78,55.22 v17,52 | v19,50.5 22.75,50.5 26.75,46.5 32.25,46.5 35,49.25 45.25,49.25 46.89,47.61 IC103.76
SWD  (via drill 0.35)
  Top 0.254: v36.5,48.5 v36.5,50.25 | v42.25,52 43.25,53 v44.5,53
  Bottom 0.254: DEBUG.4 3.98,50 3,50 1.75,48.75 1.75,45 3.25,43.5 25,43.5 27.59,46.09 32.42,46.09 35.08,48.75 36.25,48.75 v36.5,48.5 | v36.5,50.25 38.25,52 v42.25,52 | v44.5,53 44.75,52.75 44.75,51.9 46.51,50.14 IC103.72
SWO  (via drill 0.35)
  Top 0.254: DEBUG.5 1.75,45.23 v1.75,42.75
  Bottom 0.2: 3.5,42.75 11,42.75 13.5,40.25 SJ101.2 SJ100.2
  Bottom 0.254: v1.75,42.75 3.5,42.75
TACH_MCU  (via drill 0.35)
  Top 0.2: 70,34.75 v73,34.75 | v81.5,34.75 86.75,34.75 | v51.35,42.79 51.35,46.9 v46.75,51.5
  Top 0.254: v69.75,34.5 70,34.75 | 86.75,34.75 v87,34.5 | v52,41.25 52,38.75 v52.25,38.5 | v33.25,31.25 v37.75,31.25 | v47,34.5 49,36.5 v49,38.5
  Bottom 0.2: v73,34.75 v81.5,34.75 | 51.21,42.79 v51.35,42.79 | v46.75,51.5 47.61,50.64 IC103.71
  Bottom 0.254: IC100.4 14.47,19.92 14.47,22.24 TP100.TP 23.48,31.25 v33.25,31.25 | v87,34.5 87,35.75 87.25,36 95.42,36 95.72,35.7 99.05,35.7 101.25,33.5 | 51.21,42.79 52,42 v52,41.25 | v69.75,34.5 69.5,34.75 56,34.75 v52.25,38.5 v49,38.5 | v37.75,31.25 43.75,31.25 v47,34.5
  Bottom 1.016: CON101.1 101.93,33.5 101.25,33.5
VCAP1
  Bottom 0.254: C116.1 46.39,64.17 IC103.49
VCAP2
  Bottom 0.254: C107.1 49.75,50.6 49.75,49.75 49.64,49.64 IC103.73

### Text on the board
tNames: 12V | BUT4 | GND | B4 | B3 | B2 | B1 | B5 | BUT5 | BUT3 | B6 | B7 | TACH | ANODE | CATHODE | CS | COLLECTOR | CLK | BUT6 | BUT2 | DI | EMITTER | VSS | VDD | BLK | BLA | BUT7 | BUT1